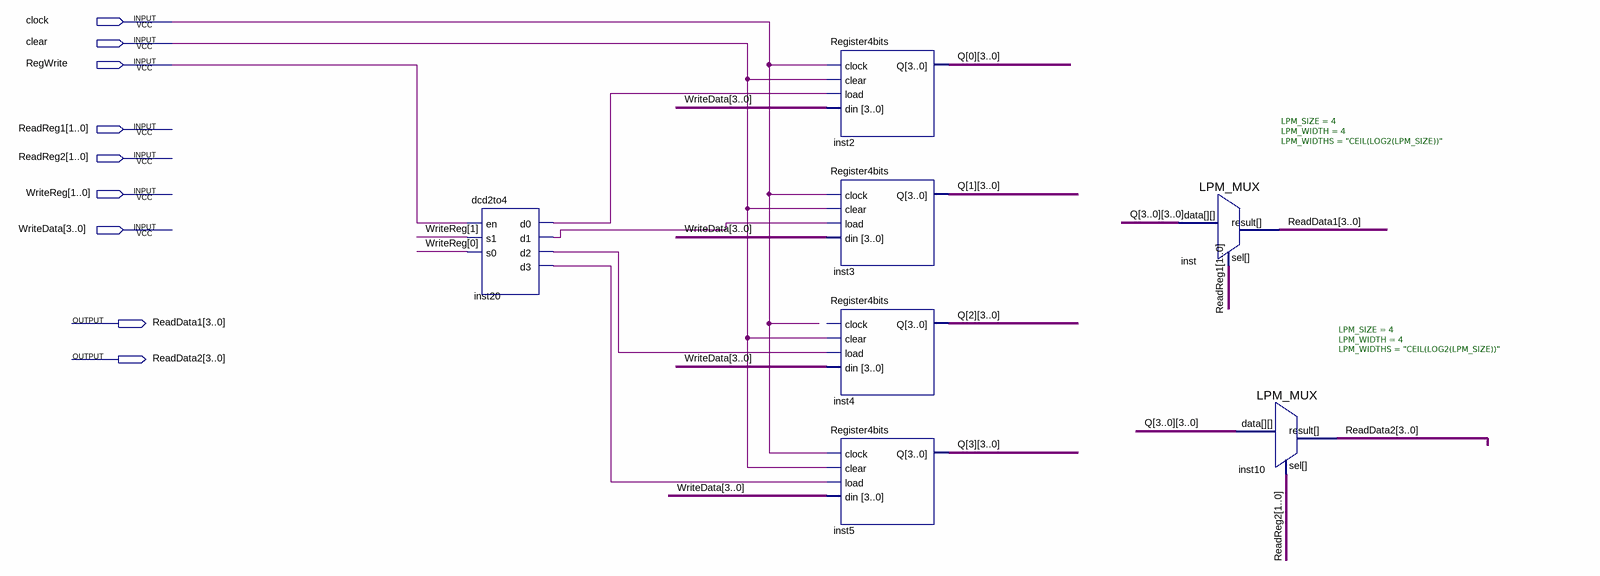
[diagram p0: schematic sheet]
// Quartus schematic RegisterBank.bdf as structural Verilog: 7 symbols, 9 pins
module RegisterBank (
  input  clock,
  input  clear,
  input  RegWrite,
  input  [1:0] ReadReg1,
  input  [1:0] ReadReg2,
  input  [1:0] WriteReg,
  input  [3:0] WriteData,
  output [3:0] ReadData1,
  output [3:0] ReadData2
);

  wire inst20_d0, inst20_d1, inst20_d2, inst20_d3;
  wire [3:0] Q_0, Q_1, Q_2, Q_3;

  dcd2to4 inst20 (
    .en(RegWrite), .s1(WriteReg[1]), .s0(WriteReg[0]), .d0(inst20_d0), .d1(inst20_d1), .d2(inst20_d2),
    .d3(inst20_d3));
  Register4bits inst2 (.clock(clock), .clear(clear), .load(inst20_d0), .din(WriteData), .Q(Q_0));
  Register4bits inst3 (.clock(clock), .clear(clear), .load(inst20_d1), .din(WriteData), .Q(Q_1));
  Register4bits inst4 (.clear(clear), .load(inst20_d2), .din(WriteData), .Q(Q_2));  // open: clock
  Register4bits inst5 (.clock(clock), .clear(clear), .load(inst20_d3), .din(WriteData), .Q(Q_3));
  LPM_MUX #(.LPM_SIZE(4), .LPM_WIDTH(4), .LPM_WIDTHS("CEIL(LOG2(LPM_SIZE))")) inst (
    .data({Q_3, Q_2, Q_1, Q_0}), .sel(ReadReg1), .result(ReadData1));
  LPM_MUX #(.LPM_SIZE(4), .LPM_WIDTH(4), .LPM_WIDTHS("CEIL(LOG2(LPM_SIZE))")) inst10 (
    .data({Q_3, Q_2, Q_1, Q_0}), .sel(ReadReg2), .result(ReadData2));
endmodule
